# EAGLE design omniphone (EAGLE 9.6.2)
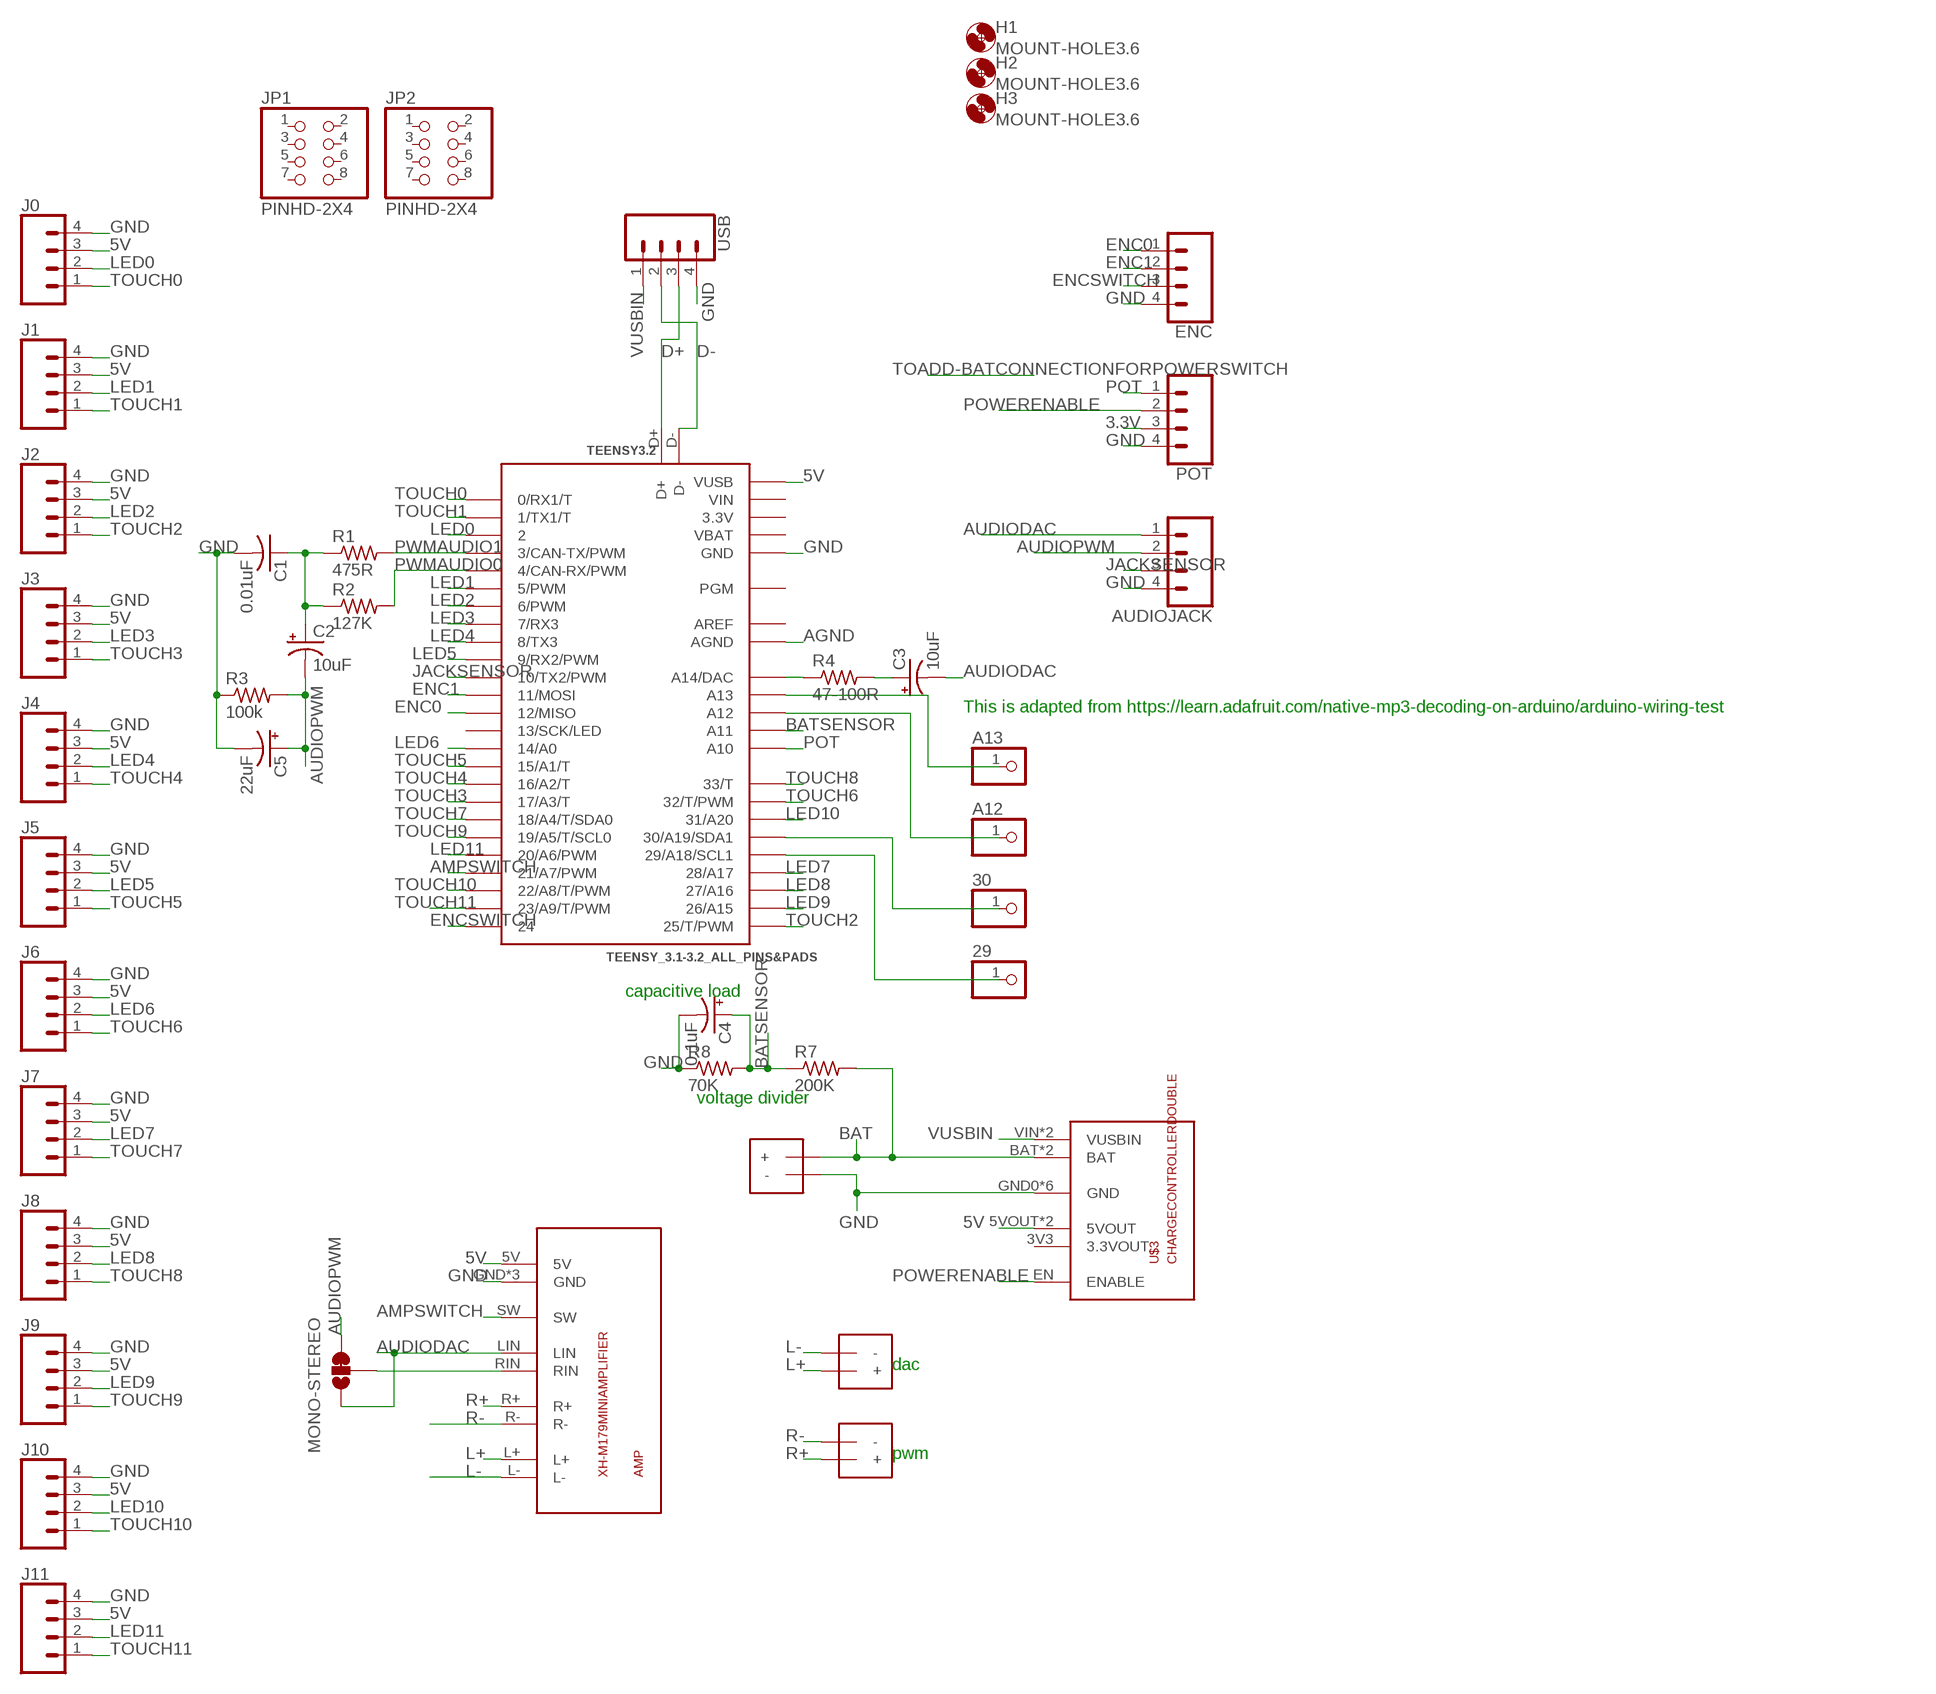
[diagram p0: schematic, sheet 1]

## Parts
29  PINHD-1X1  [1X01]
30  PINHD-1X1  [1X01]
A12  PINHD-1X1  [1X01]
A13  PINHD-1X1  [1X01]
AMP  XH-M179MINIAMPLIFIER  [XH-M179AMP]
AUDIOJACK  CONN_04POLAR_LOCK  [MOLEX-1X4_LOCK]
BATTERY  SPEAKERTERMINAL-3.5MM  [1X2-3.5MM]
C1  0.01uF  C-US025-024X044  [C025-024X044]
C2  10uF  CPOL-USE2-4  [E2-4]
C3  10uF  CPOL-USE2-4  [E2-4]
C4  0.1uF  CPOL-USE2-4  [E2-4]
C5  22uF  CPOL-USE2-4  [E2-4]
ENC  CONN_04POLAR_LOCK  [MOLEX-1X4_LOCK]
H1  MOUNT-HOLE3.6  [3,6]
H2  MOUNT-HOLE3.6  [3,6]
H3  MOUNT-HOLE3.6  [3,6]
J0  CONN_04POLAR_LOCK  [MOLEX-1X4_LOCK]
J1  CONN_04POLAR_LOCK  [MOLEX-1X4_LOCK]
J2  CONN_04POLAR_LOCK  [MOLEX-1X4_LOCK]
J3  CONN_04POLAR_LOCK  [MOLEX-1X4_LOCK]
J4  CONN_04POLAR_LOCK  [MOLEX-1X4_LOCK]
J5  CONN_04POLAR_LOCK  [MOLEX-1X4_LOCK]
J6  CONN_04POLAR_LOCK  [MOLEX-1X4_LOCK]
J7  CONN_04POLAR_LOCK  [MOLEX-1X4_LOCK]
J8  CONN_04POLAR_LOCK  [MOLEX-1X4_LOCK]
J9  CONN_04POLAR_LOCK  [MOLEX-1X4_LOCK]
J10  CONN_04POLAR_LOCK  [MOLEX-1X4_LOCK]
J11  CONN_04POLAR_LOCK  [MOLEX-1X4_LOCK]
JP1  PINHD-2X4  [2X04]
JP2  PINHD-2X4  [2X04]
MONO-STEREO  JUMPER-SMT_3_1-NC_TRACE_SILK  [SMT-JUMPER_3_1-NC_TRACE_SILK]
POT  CONN_04POLAR_LOCK  [MOLEX-1X4_LOCK]
R1  475R  R-US_0204/2V  [0204V]
R2  127K  R-US_0204/2V  [0204V]
R3  100k  R-US_0204/2V  [0204V]
R4  47-100R  R-US_0204/2V  [0204V]
R7  200K  R-US_0204/2V  [0204V]
R8  70K  R-US_0204/2V  [0204V]
SPEAKERDAC  SPEAKERTERMINAL-3.5MM  [1X2-3.5MM]
SPEAKERPWM  SPEAKERTERMINAL-3.5MM  [1X2-3.5MM]
TEENSY3.2  TEENSY_3.1-3.2_ALL_PINS&PADS  [TEENSY_3.0-3.2_ALL_PINS_&_PADS]
U$3  CHARGECONTROLLERDOUBLE  [CHARGECONTROLLERDOUBLE]
USB  CONN_04POLAR_LOCK  [MOLEX-1X4_LOCK]

## Nets
3.3V: POT.3
5V: AMP.5V J0.3 J1.3 J2.3 J3.3 J4.3 J5.3 J6.3 J7.3 J8.3 J9.3 J10.3 J11.3 TEENSY3.2.VUSB TEENSY3.2.VUSB1(VUSB) U$3.5VOUT U$3.5VOUT1(5VOUT)
AGND: TEENSY3.2.AGND
AMPSWITCH: AMP.SW TEENSY3.2.21/A7(21/A7/PWM)
AUDIODAC: AMP.LIN AUDIOJACK.1 C3.- MONO-STEREO.1
AUDIOPWM: AUDIOJACK.2 C2.- C5.+ MONO-STEREO.3 R3.2
BAT: BATTERY.+ R7.2 U$3.BAT U$3.BAT1(BAT)
BATSENSOR: C4.+ R7.1 R8.2 TEENSY3.2.A11
D+: TEENSY3.2.D+ USB.3
D-: TEENSY3.2.D- USB.2
ENC0: ENC.1 TEENSY3.2.12(12/MISO)
ENC1: ENC.2 TEENSY3.2.11(11/MOSI)
ENCSWITCH: ENC.3 TEENSY3.2.24
GND: AMP.GND AMP.GND1(GND) AMP.GND2(GND) AUDIOJACK.4 BATTERY.- C1.2 C4.- C5.- ENC.4 J0.4 J1.4 J2.4 J3.4 J4.4 J5.4 J6.4 J7.4 J8.4 J9.4 J10.4 J11.4 POT.4 R3.1 R8.1 TEENSY3.2.GND TEENSY3.2.GND1(GND) TEENSY3.2.GND2(GND) TEENSY3.2.GND3(GND) U$3.GND0(GND) U$3.GND1(GND) U$3.GND2(GND) U$3.GND3(GND) U$3.GND4(GND) U$3.GND5(GND) USB.4
JACKSENSOR: AUDIOJACK.3 TEENSY3.2.10(10/TX2/PWM)
L+: AMP.L+ SPEAKERDAC.+
L-: AMP.L- SPEAKERDAC.-
LED0: J0.2 TEENSY3.2.2
LED1: J1.2 TEENSY3.2.5(5/PWM)
LED2: J2.2 TEENSY3.2.6(6/PWM)
LED3: J3.2 TEENSY3.2.7(7/RX3)
LED4: J4.2 TEENSY3.2.8(8/TX3)
LED5: J5.2 TEENSY3.2.9(9/RX2/PWM)
LED6: J6.2 TEENSY3.2.14/A0
LED7: J7.2 TEENSY3.2.28(28/A17)
LED8: J8.2 TEENSY3.2.27(27/A16)
LED9: J9.2 TEENSY3.2.26(26/A15)
LED10: J10.2 TEENSY3.2.31(31/A20)
LED11: J11.2 TEENSY3.2.20/A6(20/A6/PWM)
N$1: C1.1 C2.+ R1.1 R2.1
N$2: A13.1 TEENSY3.2.A13
N$3: A12.1 TEENSY3.2.A12
N$5: R4.1 TEENSY3.2.RESET/DAC(A14/DAC)
N$6: 30.1 TEENSY3.2.30(30/A19/SDA1)
N$7: C3.+ R4.2
N$8: 29.1 TEENSY3.2.29(29/A18/SCL1)
POT: POT.1 TEENSY3.2.A10
POWERENABLE: POT.2 U$3.EN(ENABLE)
PWMAUDIO0: R2.2 TEENSY3.2.4(4/CAN-RX/PWM)
PWMAUDIO1: R1.2 TEENSY3.2.3(3/CAN-TX/PWM)
R+: AMP.R+ SPEAKERPWM.+
R-: AMP.R- SPEAKERPWM.-
RIN: AMP.RIN MONO-STEREO.2
TOUCH0: J0.1 TEENSY3.2.0(0/RX1/T)
TOUCH1: J1.1 TEENSY3.2.1(1/TX1/T)
TOUCH2: J2.1 TEENSY3.2.25(25/T/PWM)
TOUCH3: J3.1 TEENSY3.2.17/A3(17/A3/T)
TOUCH4: J4.1 TEENSY3.2.16/A2(16/A2/T)
TOUCH5: J5.1 TEENSY3.2.15/A1(15/A1/T)
TOUCH6: J6.1 TEENSY3.2.32(32/T/PWM)
TOUCH7: J7.1 TEENSY3.2.18/A4(18/A4/T/SDA0)
TOUCH8: J8.1 TEENSY3.2.33(33/T)
TOUCH9: J9.1 TEENSY3.2.19/A5(19/A5/T/SCL0)
TOUCH10: J10.1 TEENSY3.2.22/A8(22/A8/T/PWM)
TOUCH11: J11.1 TEENSY3.2.23/A9(23/A9/T/PWM)
VUSBIN: U$3.VIN1(VUSBIN) U$3.VIN(VUSBIN) USB.1
Unconnected: JP1.1 JP1.2 JP1.3 JP1.4 JP1.5 JP1.6 JP1.7 JP1.8 JP2.1 JP2.2 JP2.3 JP2.4 JP2.5 JP2.6 JP2.7 JP2.8 TEENSY3.2.13(13/SCK/LED) TEENSY3.2.PGM U$3.3V3(3.3VOUT)

## Notes on the sheet
- This is adapted from https://learn.adafruit.com/native-mp3-decoding-on-arduino/arduino-wiring-test
- capacitive load
- voltage divider
- dac
- pwm

## Power pins joined to a net without a drawn wire
3.3V: TEENSY3.2.3.3V TEENSY3.2.3.3V1(3.3V) TEENSY3.2.3.3V2(3.3V)
AREF: TEENSY3.2.AREF
VBAT: TEENSY3.2.VBAT
VIN: TEENSY3.2.VIN

## Library data of the parts
29 30 A12 A13 = adafruit:PINHD-1X1: Pin header 1x1 for 0.1" spacing With round pins
AMP = ArvidLibrary:XH-M179MINIAMPLIFIER
AUDIOJACK ENC J0 J1-J11 POT USB = SparkFun-Connectors:CONN_04: Multi connection point. Often used as Generic Header-pin footprint for 0.1 inch spaced/style header connections On any of the 0.1 inch spaced packages, you can populate with these: Break Away Headers - Straight <https://www.sparkfun.com/products/116> (PRT-00116) Break Away Male Headers - Right Angle <https://www.sparkfun.com/products/553> (PRT-00553) Female Headers <https://www.sparkfun.com/products/115> (PRT-00115) Break Away Headers - Machine Pin <https://www.sparkfun.com/products/117> (PRT-00117) Break Away Female Headers - Swiss Machine Pin <https://www.sparkfun.com/products/743> (PRT-00743) For SCREWTERMINALS and SPRING TERMINALS visit here: Screw Terimnals on SparkFun.com <https://www.sparkfun.com/search/results?term=Screw+Terminals> (5mm/3.5mm/2.54mm spacing) This device is also useful as a general connection point to wire up your design to another part of your project. Our various solder wires solder well into these plated through hole pads. Hook-Up Wire - Assortment (Stranded, 22 AWG) <https://www.sparkfun.com/products/11375> (PRT-11375) Hook-Up Wire - Assortment (Solid Core, 22 AWG) <https://www.sparkfun.com/products/11367> (PRT-11367) View the entire wire category on our website here <https://www.sparkfun.com/categories/141> Special notes: Molex polarized connector foot print use with SKU : PRT-08231 with associated crimp pins and housings. 1MM SMD Version SKU: PRT-10208; PROD_ID: CONN-08186; SF_ID: PRT-08231
BATTERY SPEAKERDAC SPEAKERPWM = ArvidLibrary:SPEAKERTERMINAL: 3.5mm Terminal block http://www.ladyada.net/library/pcb/eaglelibrary.html
C1 = adafruit:C-US: CAPACITOR, American symbol
C2-C5 = adafruit:CPOL-US: POLARIZED CAPACITOR, American symbol
H1-H3 = holes:MOUNT-HOLE: MOUNTING HOLE with drill center marker
JP1 JP2 = Connector:PINHD-2X4: PIN HEADER; CATEGORY: CONNECTOR; SUB-CATEGORY: PIN-HEADER
MONO-STEREO = SparkFun-Jumpers:JUMPER-SMT_3_1-NC_TRACE: Normally closed trace jumper (1 of 2 connections) This jumper has a trace between two pads so it's normally closed (NC). The other connection is normally open (NO). Use a razor knife to open the connection. For best results follow the IPC guidelines for cutting traces: Cutout at least 0.063 mm (0.005 in). Remove all loose material to clean up the cut area. Seal the cut with an approved epoxy. Reapply solder to reclose the connection, or to close the NO connection.
R1-R4 R7 R8 = adafruit:R-US_: RESISTOR, American symbol
TEENSY3.2 = ArvidLibrary:TEENSY_3.1-3.2_ALL_PINS&PADS: Footprint for Teensy 3.1 or 3.2 board using all pads and all through-holes. Pads need a 2x7 0.1" SMD header. Arvid edit: added USB data and flipped inner pins for easier assembly
U$3 = ArvidLibrary:CHARGECONTROLLERDOUBLE

## Board
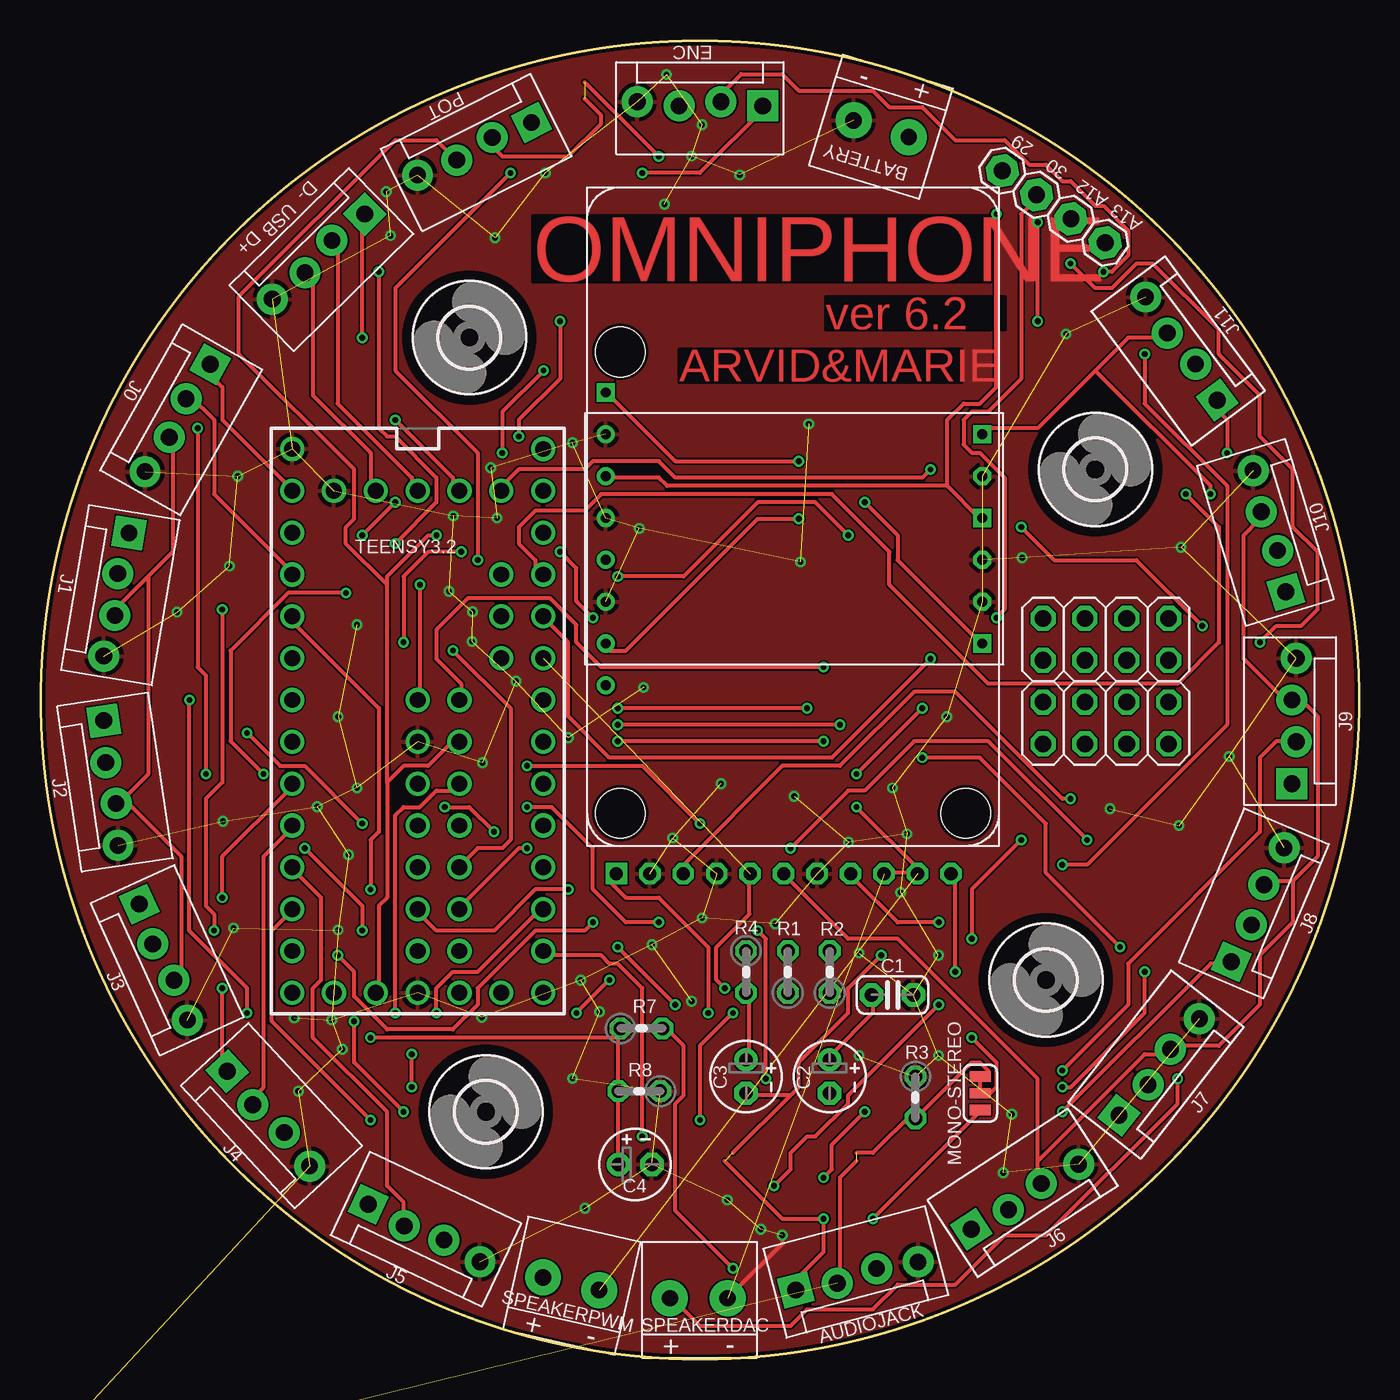
[diagram p1: board, top side]
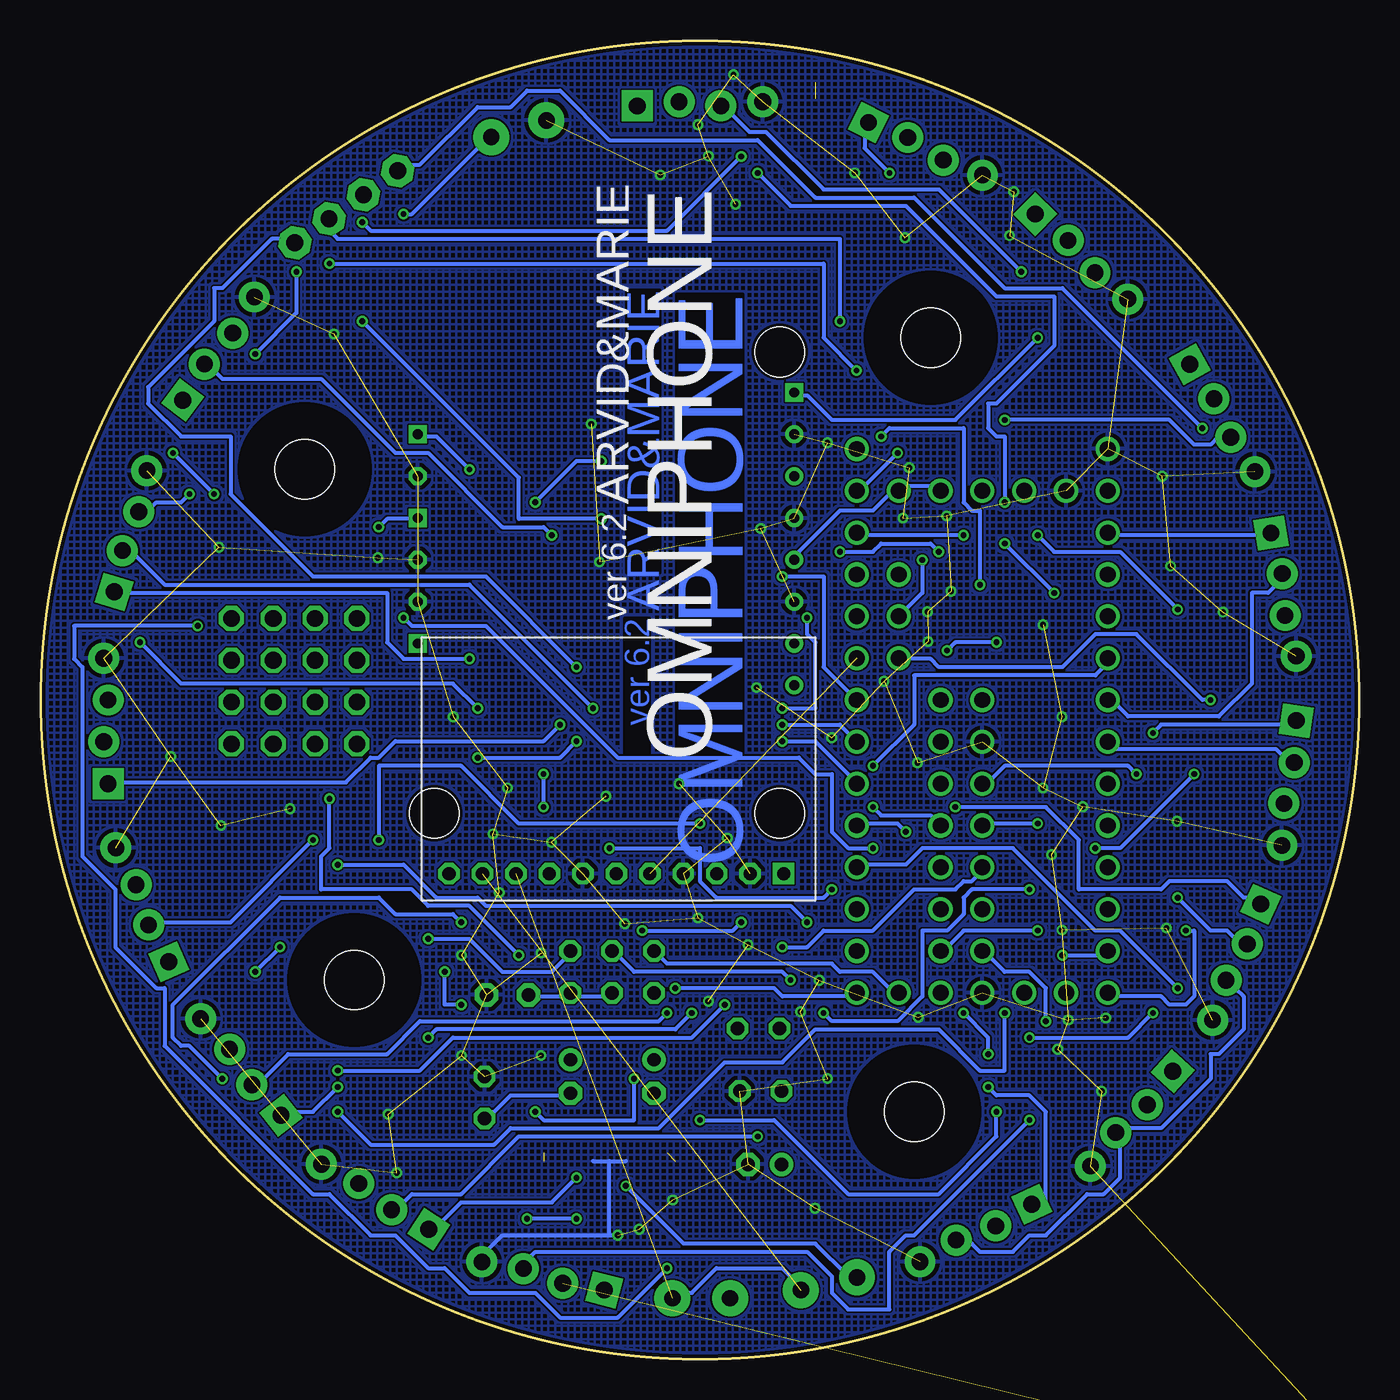
[diagram p2: board, bottom side, seen from below]

Size 80 x 80 mm. Coordinates in mm from the lower left corner, seen from the top.
Outline: circle at 40,40 radius 40
Copper layers (1*16): Top 0.035mm / dielectric 1.5mm / Bottom 0.035mm
Design rules "aisler_2_layer": minimum track width 0.1mm, minimum drill 0.2mm, track to track 0.1mm, track to pad 0.1mm, pad to pad 0.1mm, via to via 0.1mm, smd to smd 0.1mm, copper to edge 0.2mm, drill to drill 0.21mm, minimum pad ring 0.25mm, minimum via ring 0.15mm, stop-mask expansion 0mil, vias tented up to drill 0mil, thermal gap 10mil

### Footprints (pad centres in the part's own frame; a part is rotated, then mirrored left to right if it is on the bottom)
1X01 = drill 1.016 pad 1.93 octagon: 1 0,0
XH-M179AMP = drill 0.8 octagon: 5V 12.065,-1.651; GND 3.937,-1.651; GND1 8.001,-1.651; GND2 14.097,-1.651; L+ 16.129,-1.651; L- 18.161,-1.651; LIN 5.969,-1.651; R+ 22.225,-1.651; R- 20.193,-1.651; SW 10.033,-1.651 | drill 0.8 square: RIN 1.905,-1.651
MOLEX-1X4_LOCK = drill 1.016 pad 1.88 square: 1 0,0.127 | drill 1.016 pad 1.88: 2 2.54,-0.127; 3 5.08,0.127; 4 7.62,-0.127
1X2-3.5MM = drill 1 pad 2.184: + -1.7,0; - 1.8,0
C025-024X044 = drill 0.813 pad 1.422 octagon: 1 -1.27,0; 2 1.27,0
E2-4 = drill 0.813 pad 1.422: + -1.016,0 | drill 0.813 pad 1.422 octagon: - 1.016,0
3,6 = hole 3.6: 0,0
2X04 = drill 1.016 octagon: 1 -3.81,-1.27; 2 -3.81,1.27; 3 -1.27,-1.27; 4 -1.27,1.27; 5 1.27,-1.27; 6 1.27,1.27; 7 3.81,-1.27; 8 3.81,1.27
SMT-JUMPER_3_1-NC_TRACE_SILK = smd 0.635 x 1.27: 1 -1.016,0; 2 0,0; 3 1.016,0
0204V = drill 0.813 octagon: 1 -1.27,0; 2 1.27,0
TEENSY_3.0-3.2_ALL_PINS_&_PADS = drill 0.965: 0 -7.62,13.97; 1 -7.62,11.43; 2 -7.62,8.89; 3 -7.62,6.35; 3.3V 7.62,11.43; 3.3V1 -2.54,-16.51; 3.3V2 2.54,-1.27; 4 -7.62,3.81; 5 -7.62,1.27; 6 -7.62,-1.27; 7 -7.62,-3.81; 8 -7.62,-6.35; 9 -7.62,-8.89; 10 -7.62,-11.43; 11 -7.62,-13.97; 12 -7.62,-16.51; 13 7.62,-16.51; 14/A0 7.62,-13.97; 15/A1 7.62,-11.43; 16/A2 7.62,-8.89; 17/A3 7.62,-6.35; 18/A4 7.62,-3.81; 19/A5 7.62,-1.27; 20/A6 7.62,1.27; 21/A7 7.62,3.81; 22/A8 7.62,6.35; 23/A9 7.62,8.89; 24 0,-3.81; 25 0,-6.35; 26 0,-8.89; 27 0,-11.43; 28 0,-13.97; 29 2.54,-13.97; 30 2.54,-11.43; 31 2.54,-8.89; 32 2.54,-6.35; 33 2.54,-3.81; A10 5.08,6.35; A11 5.08,3.81; A12 0,1.27; A13 2.54,1.27; AGND 7.62,13.97; AREF 5.08,8.89; D+ -2.54,13.97; D- 0,13.97; GND -7.62,16.51; GND1 0,-16.51; GND2 0,-1.27; GND3 -5.08,13.97; PGM 2.54,-16.51; RESET/DAC 5.08,-16.51; VBAT -5.08,-16.51; VIN 7.62,16.51; VUSB 5.08,13.97; VUSB1 2.54,13.97
CHARGECONTROLLERDOUBLE = drill 0.6: 3V3 -22.86,-15.24; 5VOUT1 -22.86,-7.62; BAT1 -22.86,-2.54; EN -22.86,-12.7; GND3 -22.86,0; GND4 -22.86,-5.08; GND5 -22.86,-10.16 | drill 0.6 square: 5VOUT 0,0; BAT 0,-5.08; VIN 0,-12.7; VIN1 -22.86,2.54 | drill 0.6 octagon: GND0 0,-2.54; GND1 0,-7.62; GND2 0,-10.16 | hole 3: -22,-23; -1,-23; -22,5

### Placement (x,y rotation side)
29  58.36,72.13 145 top
30  60.44,70.67 145 top
A12  62.52,69.22 145 top
A13  64.6,67.76 145 top
AMP  33.02,27.81 180 bottom
AUDIOJACK  45.84,4.06 14.8 top
BATTERY  51.05,74.67 163 top
C1  51.68,22.09 0 top
C2  47.87,17.14 270 top
C3  42.79,17.14 270 top
C4  36.06,11.81 0 top
C5  -3.18,-8.26 0 top  (outside the outline)
ENC  43.81,76.19 180 top
H1  27,15 0 top
H2  61,23 0 top
H3  64,54 0 top
H4  MOUNT-HOLE3.6  [3,6]  26,62 0 top
J0  10.16,60.45 240.6 top
J1  5.2,50.16 260.4 top
J2  3.68,38.73 278.4 top
J3  5.84,27.55 294.5 top
J4  11.21,17.38 312.8 top
J5  19.81,9.27 334.7 top
J6  56.53,7.76 33.1 top
J7  65.54,14.71 52.1 top
J8  72.37,24.06 67 top
J9  76.07,34.92 90 top
J10  75.69,46.6 107 top
J11  71.5,58.28 126.7 top
JP1  64.64,43.68 0 top
JP2  64.64,38.6 0 top
MONO-STEREO  57.02,16.12 90 top
POT  29.71,75.18 206.7 top
R1  45.33,23.49 90 top
R2  47.87,23.49 90 top
R3  53.08,15.87 270 top
R4  42.79,23.49 270 top
R7  36.44,20.06 0 top
R8  36.32,16.25 180 top
SPEAKERDAC  39.87,3.68 0 top
SPEAKERPWM  32.13,4.57 347.2 top
TEENSY3.2  22.86,38.73 0 top
U$3  57.14,56.13 0 top
USB  19.55,69.59 224.5 top

### Tracks (layer width: path | path; a pad name or v marks a point on that pad's centre or on a via)
3.3V  (via drill 0.35)
  Top 0.254: 21,35 21,28 20.5,27.5 20.5,22.5 TEENSY3.2.3.3V1 | 21,35 22,36 23.5,36 25,37.5 TEENSY3.2.3.3V2 | v24,50 23.5,50 21,47.5 21,47 | 21,35 21,47 | 21,47 18.5,49.5 18.5,50.5 19,51 19,54 12,61 12,64.5 21.5,74 24,74 25,73 POT.3
  Bottom 0.254: v24,50 30,50 TEENSY3.2.3.3V
5V  (via drill 0.35)
  Top 0.254: 5,34 8.5,30.5 8.5,23 J3.3 | 6.5,47.5 8,49 8,55.5 J0.3 | 6.5,47.5 4.5,45.5 J1.3 | v21.5,57 25,53.5 25,53 TEENSY3.2.VUSB1 | 5,34 6.5,35.5 6.5,47.5 | 5,34 J2.3 | 60.5,12 60.5,11 J6.3 | 60.5,12 60.5,17 52,25.5 49,25.5 45.5,29 AMP.5V | 60.5,12 67,18.5 68.5,18.5 J7.3 69,19 71.5,19 74,21.5 74,24.5 76,26.5 76,29 | 64,60 66,62 68,62 J11.3 | 64,60 60.5,56.5 57.5,56.5 U$3.5VOUT | 76,29 74.5,29 J8.3 | 76,29 77.5,30.5 77.5,39 76.5,40 J9.3 75.5,40 73,42.5 73,50 74,51 J10.3 | 64,60 71,53 v71,52.5 | v54,54 53.5,53.5 38.5,53.5 37.5,54.5 33.5,54.5 33,54 29,54 28,53 TEENSY3.2.VUSB
  Bottom 0.254: J5.3 24,7 23.5,7 23,6.5 21,6.5 20,7.5 19,7.5 16.5,10 15.5,10 14.5,11 14.5,13.5 J4.3 14.5,14 12,14 9,17 9,18.5 8.5,18.5 7,20 7,22 7.5,22.5 8,22.5 J3.3 | U$3.5VOUT1 34,49 31.5,51.5 29.5,51.5 28.5,52.5 28,52.5 TEENSY3.2.VUSB 27.5,53 25.5,53 TEENSY3.2.VUSB1 | v21.5,57 11.5,57 10,55.5 9,55.5 8.5,56 8,56 J0.3 | v71,52.5 71.5,52 73,52 73.5,51.5 74,51.5 J10.3 | v54,54 56,56 57,56 U$3.5VOUT
AGND  (via drill 0.35)
  Top 0.254: v28,55 28,57.5 v30.5,60 | v62.5,66.5 64,65 65,65 66.5,66.5 67.5,66.5 71.5,62.5 71.5,61 74,58.5 74,56 76,54 76,50.5 77.5,49 77.5,45.5 76.5,44.5 75,44.5 v74,43.5 | v49.5,35.5 v53.5,39.5 | 53.5,29.5 v49.5,33.5
  Bottom 0.254: v28,55 30,53 TEENSY3.2.AGND | v30.5,60 32.5,62 32.5,66.5 v62.5,66.5 | v74,43.5 71.5,41 55,41 v53.5,39.5 | v49.5,33.5 v49.5,35.5
AMPSWITCH  (via drill 0.35)  (1 unrouted)
  Top 0.254: v41.5,22.5 41,23 41,25 43,27 43,29 AMP.SW
  Bottom 0.254: v41.5,22.5 35.5,22.5 35,22 30.5,22
AUDIODAC  (via drill 0.35)  (1 unrouted)
  Top 0.254: v50.5,8.5 57,15 MONO-STEREO.1 | AUDIOJACK.1 45.5,4.5 47.5,6.5 v47.5,8.5 45,8.5 41.5,12 | v62.5,34 62,34 55.5,40.5 53,40.5 48.5,36 45,36 39,30 39,29.5 AMP.LIN | v51,24.5 49,22.5 49,21 46,18 46,16.5 45.5,16 | 42,12.5 45.5,16 | 45.5,16 43,16 C3.-
  Bottom 0.254: v47.5,8.5 v50.5,8.5 | v62.5,34 62.5,31 63,30.5 63,28.5 57.5,28.5 56.5,27.5 54,27.5 v51,24.5
AUDIOPWM  (2 unrouted)
  Top 0.254: MONO-STEREO.3 57.5,17 57.5,17.5 57,18 56.5,18 53.5,15 R3.2 53,15 50.5,12.5 49.5,12.5 | 49.5,12 48.5,11 48.5,5 AUDIOJACK.2
  Bottom 0.254: C2.- 48,16 51.5,16 52.5,15 53,15 R3.2
BAT  (via drill 0.35)
  Top 0.254: 55,53 38,53 37.5,53.5 34.5,53.5 U$3.BAT1 | 55,53 57,51 U$3.BAT | v42,5.5 38.5,9 38.5,15.5 39,16 39,19 38,20 R7.2 | v70.5,44.5 66.5,48.5 61.5,48.5 v59.5,50.5 | v58,69.5 58,59 57,58 56,58 55,57 55,53
  Bottom 0.254: v42,5.5 45,2.5 48.5,2.5 50,4 54,4 55.5,5.5 56.5,5.5 58.5,7.5 60,7.5 62.5,10 63.5,10 72.5,19 72.5,22.5 73,22.5 75.5,25 75.5,28.5 77.5,30.5 77.5,42 78,42.5 78,44.5 v70.5,44.5 | v59.5,50.5 59,51 57.5,51 U$3.BAT | v58,69.5 57.5,69.5 53,74 BATTERY.+
BATSENSOR  (via drill 0.35)
  Top 0.254: 35,19.5 35,20 R7.1 35,19.5 | 35,19.5 35,16.5 R8.2 35,16 35,12 C4.+ | v9,40 9,26 12.5,22.5 v12.5,21 | 35,19.5 v20,19.5
  Bottom 0.254: v9,40 9.5,40 13.5,44 16,44 18,42 25.5,42 26,42.5 27.5,42.5 TEENSY3.2.A11 | v12.5,21 14,19.5 v20,19.5
D+
  Top 0.254: TEENSY3.2.D+ 20,53 20,55 16.5,58.5 16.5,65.5 USB.3
D-
  Top 0.254: TEENSY3.2.D- 22.5,53 22.5,53.5 18,58 18,67.5 USB.2
ENC0  (via drill 0.35)
  Top 0.254: v10.5,26 10.5,27 10,27.5 10,34 11,35 v11,45.5 | v21.5,52 v19.5,50 | v36.5,72 40,72 44,76 ENC.1
  Bottom 0.254: v10.5,26 10,26 10,22 10.5,21.5 11.5,21.5 12,22 15,22 TEENSY3.2.12 | v11,45.5 14.5,49 18.5,49 v19.5,50 | v21.5,52 21.5,56 22,56 22.5,56.5 22.5,58 22,58 18.5,61.5 18.5,64.5 22,64.5 27.5,70 34.5,70 v36.5,72
ENC1  (via drill 0.35)
  Top 0.254: v18,24.5 19,23.5 19,22 21,20 25,20 26.5,21.5 26.5,22.5 30,26 33,26 v33.5,26.5 | v62,30 63.5,30 72,38.5 72,53 67,58 v67,61 | v64.5,66 65,66 66,67 66,68.5 64.5,70 64,70 62.5,71.5 62,71.5 61,72.5 60,72.5 58.5,74 55.5,74 53.5,76 51.5,76 50.5,77 46,77 45,78 42.5,78 41,76.5 ENC.2
  Bottom 0.254: v18,24.5 15.5,24.5 TEENSY3.2.11 | v33.5,26.5 34.5,27.5 53,27.5 53.5,28 56,28 58,30 v62,30 | v67,61 64.5,63.5 v64.5,66
ENCSWITCH  (via drill 0.35)
  Top 0.254: v13.5,35.5 11.5,37.5 11.5,43 15,46.5 v18.5,46.5 | v21.5,49.5 24,52 24,53.5 21.5,56 21,56 20.5,56.5 v20.5,66
  Bottom 0.254: v13.5,35.5 14,36 21.5,36 22.5,35 TEENSY3.2.24 | v21.5,49.5 v18.5,46.5 | v20.5,66 25.5,71 32.5,71 36,74.5 37,74.5 38.5,76 ENC.3
GND  (via drill 0.35)  (103 unrouted)
  Top 0.254: 42,4 45,7 v45,7.5
  Bottom 0.254: 46.5,12 45.5,12 | 45.5,12 44.5,12 | 45.5,7.5 45.5,12 | 45.5,7.5 52,7.5 53.5,6 AUDIOJACK.4 | 45.5,7.5 v45,7.5
  other vias: 20.95,70.86 37.97,77.97 40.13,74.92 39.49,73.02 42.41,71.88 37.84,70.1 27.55,68.07 21.2,68.19 11.43,48.13 8.25,45.33 11.93,53.59 36.32,50.41 46.6,56.76 32.25,55.62 62.23,62.23 30.6,72 46.1,48.38 41.27,34.92 45.72,34.16 49.02,31.36 52.57,31.87 64.89,33.4 69.08,32.38 72.13,36.57 69.21,49.27 59.56,48.64 18.03,38.98 19.17,44.57 11.04,32.63 16.76,33.52 19.17,34.67 32.25,17.01 33.02,9.14 41.65,9.65 43.68,7.87 37.08,25.14 58.41,11.3 58.92,14.85 54.48,18.41 49.65,18.41 38.35,31.62 52.19,28.32 51.68,34.67 54.48,24.51 54.99,38.98 26.79,36.19 28.82,41.14 24.76,46.6 26.16,43.56 27.68,51.05 25.01,51.18 27.3,54.1 40.13,26.77 44.57,26.41 49.65,24.63 39.49,21.71 33.9,21.08 32.76,22.98 26.75,20.74 15.62,16.25 11.68,26.16 18.03,26.03 18.66,30.6 17.65,20.57 15.36,20.7 18.28,18.79 32,37.71 36.57,40.76 26.18,45.36
  pour Top: 40,83.18 60.32,83.18 83.18,60.32 83.18,22.22 57.78,-3.18 22.22,-3.18 -5.72,24.76 -5.72,57.78 17.14,80.64 19.68,83.18
  pour Bottom (hatched): 40,83.18 19.68,83.18 -3.18,60.32 -3.18,22.22 22.22,-3.18 57.78,-3.18 85.72,24.76 85.72,57.78 62.86,80.64 60.32,83.18
JACKSENSOR  (via drill 0.35)
  Top 0.254: v20,14.5 14,20.5 14,26 15,27 TEENSY3.2.10
  Bottom 0.254: v20,14.5 27,7.5 27.5,7.5 28.5,6.5 28.5,3 31,3 32,4 32,5 33.5,6.5 50,6.5 51,5.5 AUDIOJACK.3
L+  (via drill 0.35)
  Top 0.254: v54.5,26.5 52,26.5 49.5,29 AMP.L+ | v69,17 69,15.5 61,7.5 58.5,7.5 55.5,4.5 52,4.5 50.5,3 46.5,3 45.5,2 40,2 38.5,3.5 SPEAKERDAC.+
  Bottom 0.254: v54.5,26.5 55,27 58.5,27 59.5,28 65.5,28 72,21.5 72,19.5 71.5,19 71,19 v69,17
L-  (1 unrouted)
  Top 0.254: 53,29.5 51.5,29.5 AMP.L-
  Bottom 0.254: 34,4.5 35,5.5 39,5.5 40.5,4 41.5,4 SPEAKERDAC.-
LED0
  Top 0.254: TEENSY3.2.2 15,48 10.5,52.5 10.5,57 9,58.5 J0.2
LED1
  Bottom 0.254: TEENSY3.2.5 15,40 14,39 8.5,39 6.5,41 6.5,46.5 5.5,46.5 4.5,47.5 J1.2
LED2
  Bottom 0.254: TEENSY3.2.6 15,37 5,37 4.5,36.5 4,36.5 J2.2
LED3  (via drill 0.35)
  Top 0.254: v11,28 11,30.5 15,34.5 TEENSY3.2.7
  Bottom 0.254: v11,28 9,26 8,26 7.5,25.5 7,25.5 J3.2
LED4
  Top 0.254: TEENSY3.2.8 15,32 13.5,30.5 13.5,16.5 12.5,15.5 J4.2
LED5
  Top 0.254: TEENSY3.2.9 15.5,29.5 17,28 17,23 16.5,22.5 16.5,19.5 21,15 21,10.5 22,9.5 22,8.5 J5.2
LED6  (via drill 0.35)
  Top 0.254: v36.5,13.5 36.5,22.5 35,24 34.5,24 34,24.5 30.5,24.5 TEENSY3.2.14/A0
  Bottom 0.254: v36.5,13.5 51,13.5 54.5,10 57.5,10 58,9.5 58.5,9.5 J6.2
LED7  (via drill 0.35)
  Top 0.254: v19,20.5 19,18 v22,15 | v40,14.5 40,19 v42,21
  Bottom 0.254: v19,20.5 19,22.5 20,23.5 21.5,23.5 22.5,24.5 TEENSY3.2.28 | v22,15 22,13.5 25.5,10 31,10 35.5,14.5 v40,14.5 | v42,21 42.5,20.5 57,20.5 59,18.5 65,18.5 66.5,17 67,17 J7.2
LED8  (via drill 0.35)
  Top 0.254: v32,28.5 30,28.5 27.5,26 24,26 23,27 TEENSY3.2.27 | v45.5,31 49,34.5 50,34.5 53,37.5 57.5,37.5 v63.5,31.5
  Bottom 0.254: v32,28.5 32.5,28 39,28 40,29 40,31 v45.5,31 | v63.5,31.5 68.5,26.5 73,26.5 J8.2
LED9  (via drill 0.35)
  Top 0.254: v38.5,21.5 v35,25 | v62,17.5 66,21.5 66,24 74,32 74,36.5 75,37.5 76,37.5 J9.2
  Bottom 0.254: v35,25 33.5,25 32.5,26 29.5,26 27,28.5 24.5,28.5 24,29 23.5,29 23,29.5 TEENSY3.2.26 | v38.5,21.5 40.5,19.5 55,19.5 57,17.5 v62,17.5
LED10  (via drill 0.35)
  Top 0.254: v25,43 28.5,39.5 28.5,31.5 28,31 26.5,31 25.5,30 TEENSY3.2.31 | v22,43.5 22,47.5 23.5,49 v25.5,49 | v31.5,49 32.5,48 32.5,46 v33.5,45 | v46.5,39.5 v35,39.5
  Bottom 0.254: v25,43 24.5,43.5 v22,43.5 | v25.5,49 26,49.5 29,49.5 29.5,49 v31.5,49 | v33.5,45 33.5,44 33,43.5 33,39.5 v35,39.5 | v46.5,39.5 54,47 72.5,47 74.5,49 75,49 J10.2
LED11  (via drill 0.35)
  Top 0.254: v35,47.5 39,47.5 43.5,52 47,52 v49,50
  Bottom 0.254: v35,47.5 32.5,47.5 32.5,42 30.5,40 TEENSY3.2.20/A6 | v49,50 49.5,50.5 52,50.5 56.5,55 58.5,55 63,59.5 69,59.5 69.5,60 70,60 J11.2
N$1
  Top 0.254: C2.+ 48,18.5 50.5,21 50.5,22 C1.1
  Bottom 0.254: R1.1 45.5,22 47.5,22 R2.1 48,22 50,22 C1.1
N$2  (via drill 0.35)
  Top 0.254: v47.5,42 34,42 32.5,43.5 32.5,44.57 30.9,46.17 25.91,46.17 24,44.26 24,42.5 25.5,41 25.5,40 TEENSY3.2.A13
  Bottom 0.254: v47.5,42 53,47.5 63.5,47.5 68.5,52.5 68.5,56 71.5,56 73.5,58 73.5,59 69.5,63 69.5,65 69,65 66,68 65,68 A13.1
N$3  (via drill 0.35)
  Top 0.254: v23,47 23,40 TEENSY3.2.A12 | v29,56 29,57 31.5,59.5 v31.5,63
  Bottom 0.254: v23,47 23,51.5 23.5,51.5 24,52 24,56.5 28.5,56.5 v29,56 | v31.5,63 31.5,68 62,68 63,69 A12.1
N$5
  Bottom 0.254: R4.1 42.5,24.5 42,24 32,24 31.5,23.5 29.5,23.5 28.5,22.5 28,22.5 TEENSY3.2.RESET/DAC
N$6  (via drill 0.35)
  Top 0.254: v29.5,31 29,31 25.5,27.5 TEENSY3.2.30 | v58,45 58.5,45.5 58.5,53.5 57,55 56.5,55 56,55.5 56,57 56.5,57.5 57.5,57.5 59.5,59.5 59.5,69.5 60.5,70.5 30.1
  Bottom 0.254: v29.5,31 31,31 32,32 32,35.5 33,35.5 34,36.5 45,36.5 53,44.5 57.5,44.5 v58,45
N$7
  Top 0.254: R4.2 43,22 43,18.5 C3.+
N$8  (via drill 0.35)
  Top 0.254: v19.5,26 19.5,27.5 v16,31 | v10,35.5 10,41.5 9.5,42 v9.5,56.5
  Bottom 0.254: v19.5,26 24,26 25,25 TEENSY3.2.29 | v16,31 14.5,31 v10,35.5 | v9.5,56.5 18,65 21.5,65 27,70.5 33,70.5 36.5,74 45.5,74 48.5,77 50.5,77 51.5,76 53.5,76 57,72.5 58,72.5 29.1
POT  (via drill 0.35)
  Top 0.254: v26.5,48.5 26.5,55 21.5,60 21.5,65 v28.5,72
  Bottom 0.254: v26.5,48.5 26.5,46.5 27.5,45.5 TEENSY3.2.A10 | v28.5,72 30,73.5 30,75 POT.1
POWERENABLE  (via drill 0.35)  (1 unrouted)
  Top 0.254: v37.5,73 33,77.5 | v60.5,63 v60.5,69 | v46,51 43.5,51 35.5,43 34.5,43 U$3.EN | 33,76.5 34,75.5 34,75 32,73 28,73 27,74 POT.2
  Bottom 0.254: v37.5,73 42,68.5 60,68.5 v60.5,69 | v60.5,63 51,53.5 51,51 v46,51
PWMAUDIO0  (via drill 0.35)
  Top 0.254: v56.5,25.5 56.5,28.5 v59.5,31.5 | v40,32.5 36.5,36 v29.5,36
  Bottom 0.254: v56.5,25.5 54,25.5 52,23.5 49,23.5 48,24.5 R2.2 | v59.5,31.5 59.5,36 54.5,36 51,32.5 v40,32.5 | v29.5,36 27,38.5 27,41.5 16,41.5 15,42.5 TEENSY3.2.4
PWMAUDIO1  (via drill 0.35)
  Top 0.254: v32.5,21 v34.5,23 | v20,28.5 20,31.5 20.5,32 20.5,39.5 15,45 TEENSY3.2.3
  Bottom 0.254: v34.5,23 35,23.5 44,23.5 45,24.5 R1.2 | v32.5,21 32,20.5 28,20.5 26.5,22 26.5,26 25,26 24,27 24,28 23.5,28.5 v20,28.5
R+  (via drill 0.35)
  Top 0.254: v55.5,23.5 55.5,29 AMP.R+ | v54.5,21.5 49,16 49,15.5 47,13.5 46.5,13.5 45.5,12.5 45.5,11.5 v44.5,10.5
  Bottom 0.254: v55.5,23.5 55.5,21.5 v54.5,21.5 | v44.5,10.5 41,7 33,7 31,5 30.5,5 SPEAKERPWM.+
R-  (1 unrouted)
RIN  (via drill 0.35)
  Top 0.254: v56.5,19.5 58,18 58,16.5 57.5,16 MONO-STEREO.2 | v40.5,21 40.5,25 37.5,28 35.5,28 34.5,29 AMP.RIN
  Bottom 0.254: v56.5,19.5 56,20 41.5,20 v40.5,21
TOUCH0
  Top 0.254: TEENSY3.2.0 15,53 11,57 11,59 10,60 J0.1
TOUCH1
  Bottom 0.254: TEENSY3.2.1 15,50 5.5,50 J1.1
TOUCH2  (via drill 0.35)
  Top 0.254: v19.5,32.5 16,36 14.5,36 v12.5,38
  Bottom 0.254: v19.5,32.5 22.5,32.5 TEENSY3.2.25 | v12.5,38 12,38.5 4,38.5 J2.1
TOUCH3  (via drill 0.35)
  Top 0.254: v27.5,32 26,33.5 v24.5,33.5
  Bottom 0.254: v27.5,32 28,32.5 30,32.5 TEENSY3.2.17/A3 | v24.5,33.5 19,33.5 17,31.5 17,28.5 12,28.5 11.5,29 8,29 7,28 6,28 J3.1
TOUCH4  (via drill 0.35)
  Top 0.254: v11,22.5 11,17.5 J4.1
  Bottom 0.254: v11,22.5 14.5,26 16,26 21,31 26.5,31 27.5,30 30,30 TEENSY3.2.16/A2
TOUCH5  (via drill 0.35)
  Top 0.254: v24,21 24,22.5 25,23.5 26.5,23.5 30,27 TEENSY3.2.15/A1 | v22.5,16.5 v22.5,18.5
  Bottom 0.254: v24,21 22.5,19.5 v22.5,18.5 | v22.5,16.5 22,16 20,16 19,15 19,9 19.5,9 J5.1
TOUCH6  (via drill 0.35)
  Top 0.254: v29.5,33.5 31,33.5 33.5,31 33.5,28.5 35.5,26.5 v37.5,26.5 | v43.5,26 44,25.5 v44,17 | v50,15 48,13 48,11.5 v47.5,11
  Bottom 0.254: v29.5,33.5 29,33 26,33 25.5,32.5 TEENSY3.2.32 | v37.5,26.5 38,26 v43.5,26 | v44,17 44,14.5 49.5,14.5 v50,15 | v47.5,11 49,9.5 54.5,9.5 56,8 J6.1
TOUCH7  (via drill 0.35)
  Top 0.254: v47.5,37.5 v35,37.5 | v53.5,36.5 57,36.5 61,32.5 61,29.5 v65.5,25 | v67,23.5 67,21 62.5,16.5 v62,16.5
  Bottom 0.254: v35,37.5 33,37.5 30.5,35 TEENSY3.2.18/A4 | v47.5,37.5 48.5,36.5 v53.5,36.5 | v67,23.5 v65.5,25 | v62,16.5 63.5,15 65,15 J7.1
TOUCH8  (via drill 0.35)
  Top 0.254: v21.5,21 21.5,33 22,33.5 23,33.5 24,34.5 25,34.5 TEENSY3.2.33 | v62,15 71,24 72,24 J8.1
  Bottom 0.254: v21.5,21 21.5,17.5 23,17.5 25.5,20 33,20 35,18 38.5,18 42.5,14 51.5,14 52.5,13 60,13 v62,15
TOUCH9  (via drill 0.35)
  Top 0.254: v48.5,38.5 v35,38.5
  Bottom 0.254: v35,38.5 31.5,38.5 30.5,37.5 TEENSY3.2.19/A5 | v48.5,38.5 49.5,37.5 58.5,37.5 59.5,36.5 60,36.5 61.5,35 75.5,35 J9.1
TOUCH10  (via drill 0.35)
  Top 0.254: v54,42.5 48,36.5 34.5,36.5 32,39 32,43.5 30.5,45 TEENSY3.2.22/A8
  Bottom 0.254: v54,42.5 58,42.5 59,43.5 59,46.5 75.5,46.5 J10.1
TOUCH11  (via drill 0.35)
  Top 0.254: v69.5,52.5 71.5,50.5 71.5,43.5 69,41 57.5,41 51.5,47 51.5,49 48,52.5 34,52.5 33,51.5 30,51.5 29,50.5 29,49.5 30,48.5 30,48 TEENSY3.2.23/A9 | v72,55 72,57 71,58 J11.1
  Bottom 0.254: v72,55 v69.5,52.5
VUSBIN  (via drill 0.35)
  Top 0.254: v50,52 52,50 52,48.5 57,43.5 U$3.VIN | v46,54.5 38.5,54.5 34.5,58.5 U$3.VIN1 | v19.5,62 19.5,69.5 USB.1
  Bottom 0.254: v50,52 47.5,54.5 v46,54.5 | v19.5,62 24.5,57 32,57 33.5,58.5 34,58.5 U$3.VIN1

### Text on the board
Top: OMNIPHONE | ver 6.2 | ARVID&MARIE
Bottom: OMNIPHONE | ARVID&MARIE | ver 6.2
tPlace: D- | D+
bPlace: OMNIPHONE | ARVID&MARIE | ver 6.2